# Altium schematic sheet Sync Decoder.SchDoc: Sync Decoder
size A4; Organization: Altium Limited; Address1: L3, 12a Rodborough Rd; Address2: Frenchs Forest; Address3: NSW; Address4: Australia 2086; Revision: 1; SheetNumber: 3; SheetTotal: 11; Alumno: Diego Caceres; Curso: R1051; Materia: Sistemas de Representación; Docentes: Ing. Perdomo, Ing. Fuoco, Ing. Giorno, Sr. Vergili
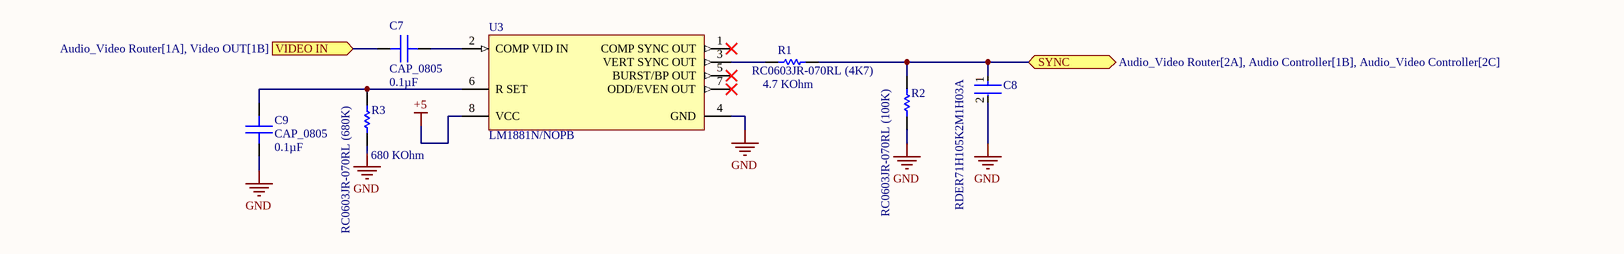
[diagram p0: Sync Decoder.SchDoc]

## Parts
C7  CAP_0805  value 0.1µF  [0805_CAPACITOR_DCACERES]
C8  RDER71H105K2M1H03A  [FP-RDE2M1-MFG]
C9  CAP_0805  value 0.1µF  [0805_CAPACITOR_DCACERES]
R1  RC0603JR-070RL (4K7)  Resistance: 4.7 KOhm  [RESC1608X55X25ML10T15]
R2  RC0603JR-070RL (100K)  [RESC1608X55X25ML10T15]
R3  RC0603JR-070RL (680K)  Resistance: 680 KOhm  [RESC1608X55X25ML10T15]
U3  LM1881N/NOPB  [P0008A]

## Ports
SYNC (bidir, see Audio_Video Router[2A], Audio Controller[1B], Audio_Video Controller[2C]), VIDEO IN (in, see Audio_Video Router[1A], Video OUT[1B])

## Nets
+5: U3.8(VCC)
GND: C8.2 C9.1 R2.1 R3.1 U3.4(GND)
SYNC: C8.1 R1.1 R2.2 ; port SYNC
VIDEO IN: C7.1 ; port VIDEO IN
NetC7_2: C7.2 U3.2(COMP_VID_IN)
NetC9_2: C9.2 R3.2 U3.6(R_SET)
NetR1_2: R1.2 U3.3(VERT_SYNC_OUT)

Not connected (* = marked no-connect by the designer): U3 1(COMP_SYNC_OUT)* 5(BURST/BP_OUT)* 7(ODD/EVEN_OUT)*

## Notes on the sheet
- Title:
- Revision:
- Alumno:
- Materia:
- Docentes:
- Curso:
- File:
- Date:
- Sheet
- of

## Library data of the parts
C7 C9 = CAPACITOR_0805_Caceres: Capacitor SMD, encapsulado 0805; SizePackage: 0805; ComponentLink1Description: Datasheet1; ComponentLink1URL: https://www.mouser.com/datasheet/2/40/AutoMLCCKAM-3216307.pdf; ComponentLink2Description: Datasheet2; ComponentLink2URL: https://www.mouser.com/datasheet/2/447/KEM_C1086_U2J-3316409.pdf; ComponentLink3Description: Datasheet3; ComponentLink3URL: https://product.tdk.com/system/files/dam/doc/product/capacitor/ceramic/mlcc/catalog/mlcc_commercial_soft_en.pdf
C8 = CMP-06035-045612-1: Ceramic Capacitor 1uF ±10% 50V X7R Radial; Lead Diameter: 0.5mm; Lead/Base Style: Kinked; Height - Seated (Max): 0.236inch; Tolerance: 10%; Height: 4mm; Package Quantity: 2000; Termination: Radial; Voltage Rating: 50V; Width: 4mm; Voltage Rating (DC): 50V; Lead Free: Lead Free; Case/Package: Radial; Length: 0.217inch; Mount: Through Hole; Dielectric: X7R; Packaging: Tape and Reel; Min Operating Temperature: -55°C; Max Operating Temperature: 125°C; Lead Pitch: 0.197inch; Capacitance: 1uF; Resistor Type: Ceramic
R1 R3 = CMP-2100-03667-1: Chip Resistor, 0 Ohm, +/- 5%, 0.1 W, -55 to 155 degC, 0603 (1608 Metric), RoHS, Tape and Reel; Manufacturer: Yageo; Temperature Coefficient: 200ppm/degreesC; Voltage Rating: 50V; Power Rating: 100mW; Width: 0.8mm; Max Operating Temperature: 155degC; Tolerance: 5%; Package Reference: 0603; Height: 0.45mm; Depth: 0.8mm; Package Description: 2-Pin Surface Mount Device, Body 1.6 x 0.8 mm; Termination: SMD/SMT; Package Quantity: 5000; Case/Package: 0603; Case Code (Imperial): 0603; Radiation Hardening: No; Number of Pins: 2; Length: 1.6mm; Lead Free: LeadFree; Voltage Rating (DC): 50V; Military Standard: Not; Datasheet URL: http://www.yageo.com/NewPortal/yageodocoutput?fileName=/pdf/R-Chip/PYu-RC_Group_51_RoHS_L_5.pdf; Manufacturer URL: http://www.yageo.com/; Packaging: TapeandReel; Case Code (Metric): 1608; Min Operating Temperature: -55degC; Composition: ThickFilm; RoHSCompliant: true; Contact Plating: Tin; Datasheet Version: Rev. 5, 10/2016; REACH SVHC: NoSVHC
R2 = CMP-2100-03667-1: Chip Resistor, 0 Ohm, +/- 5%, 0.1 W, -55 to 155 degC, 0603 (1608 Metric), RoHS, Tape and Reel; Manufacturer: Yageo; Temperature Coefficient: 200ppm/degreesC; Voltage Rating: 50V; Power Rating: 100mW; Resistance: 0mOhm; Width: 0.8mm; Max Operating Temperature: 155degC; Tolerance: 5%; Package Reference: 0603; Height: 0.45mm; Depth: 0.8mm; Package Description: 2-Pin Surface Mount Device, Body 1.6 x 0.8 mm; Termination: SMD/SMT; Package Quantity: 5000; Case/Package: 0603; Case Code (Imperial): 0603; Radiation Hardening: No; Number of Pins: 2; Length: 1.6mm; Lead Free: LeadFree; Voltage Rating (DC): 50V; Military Standard: Not; Datasheet URL: http://www.yageo.com/NewPortal/yageodocoutput?fileName=/pdf/R-Chip/PYu-RC_Group_51_RoHS_L_5.pdf; Manufacturer URL: http://www.yageo.com/; Packaging: TapeandReel; Case Code (Metric): 1608; Min Operating Temperature: -55degC; Composition: ThickFilm; RoHSCompliant: true; Contact Plating: Tin; Datasheet Version: Rev. 5, 10/2016; REACH SVHC: NoSVHC
U3 = CMP-0064-00008-3: Video Sync Separator, 8-pin MDIP, Pb-Free; Manufacturer: Texas Instruments; CompType: OtherParts; PowerWise: N; PackageTopMarking: NSUZXYTTE#*LM1881N; RoHS: Y; ComponentLink1Description: Datasheet URL; Code_JEDEC: MS-001-BA; PinCount: 8; PackageDescription: MDIP, .365 x .250 x .130in, 8 Lead, .100in Pitch; PackageReference: P0008A; ComponentLink1URL: http://www.ti.com/general/docs/lit/getliterature.tsp?genericPartNumber=LM1881&fileType=pdf